# EAGLE design AVR ISP6 to ISP10 board 2 (EAGLE 5.07)
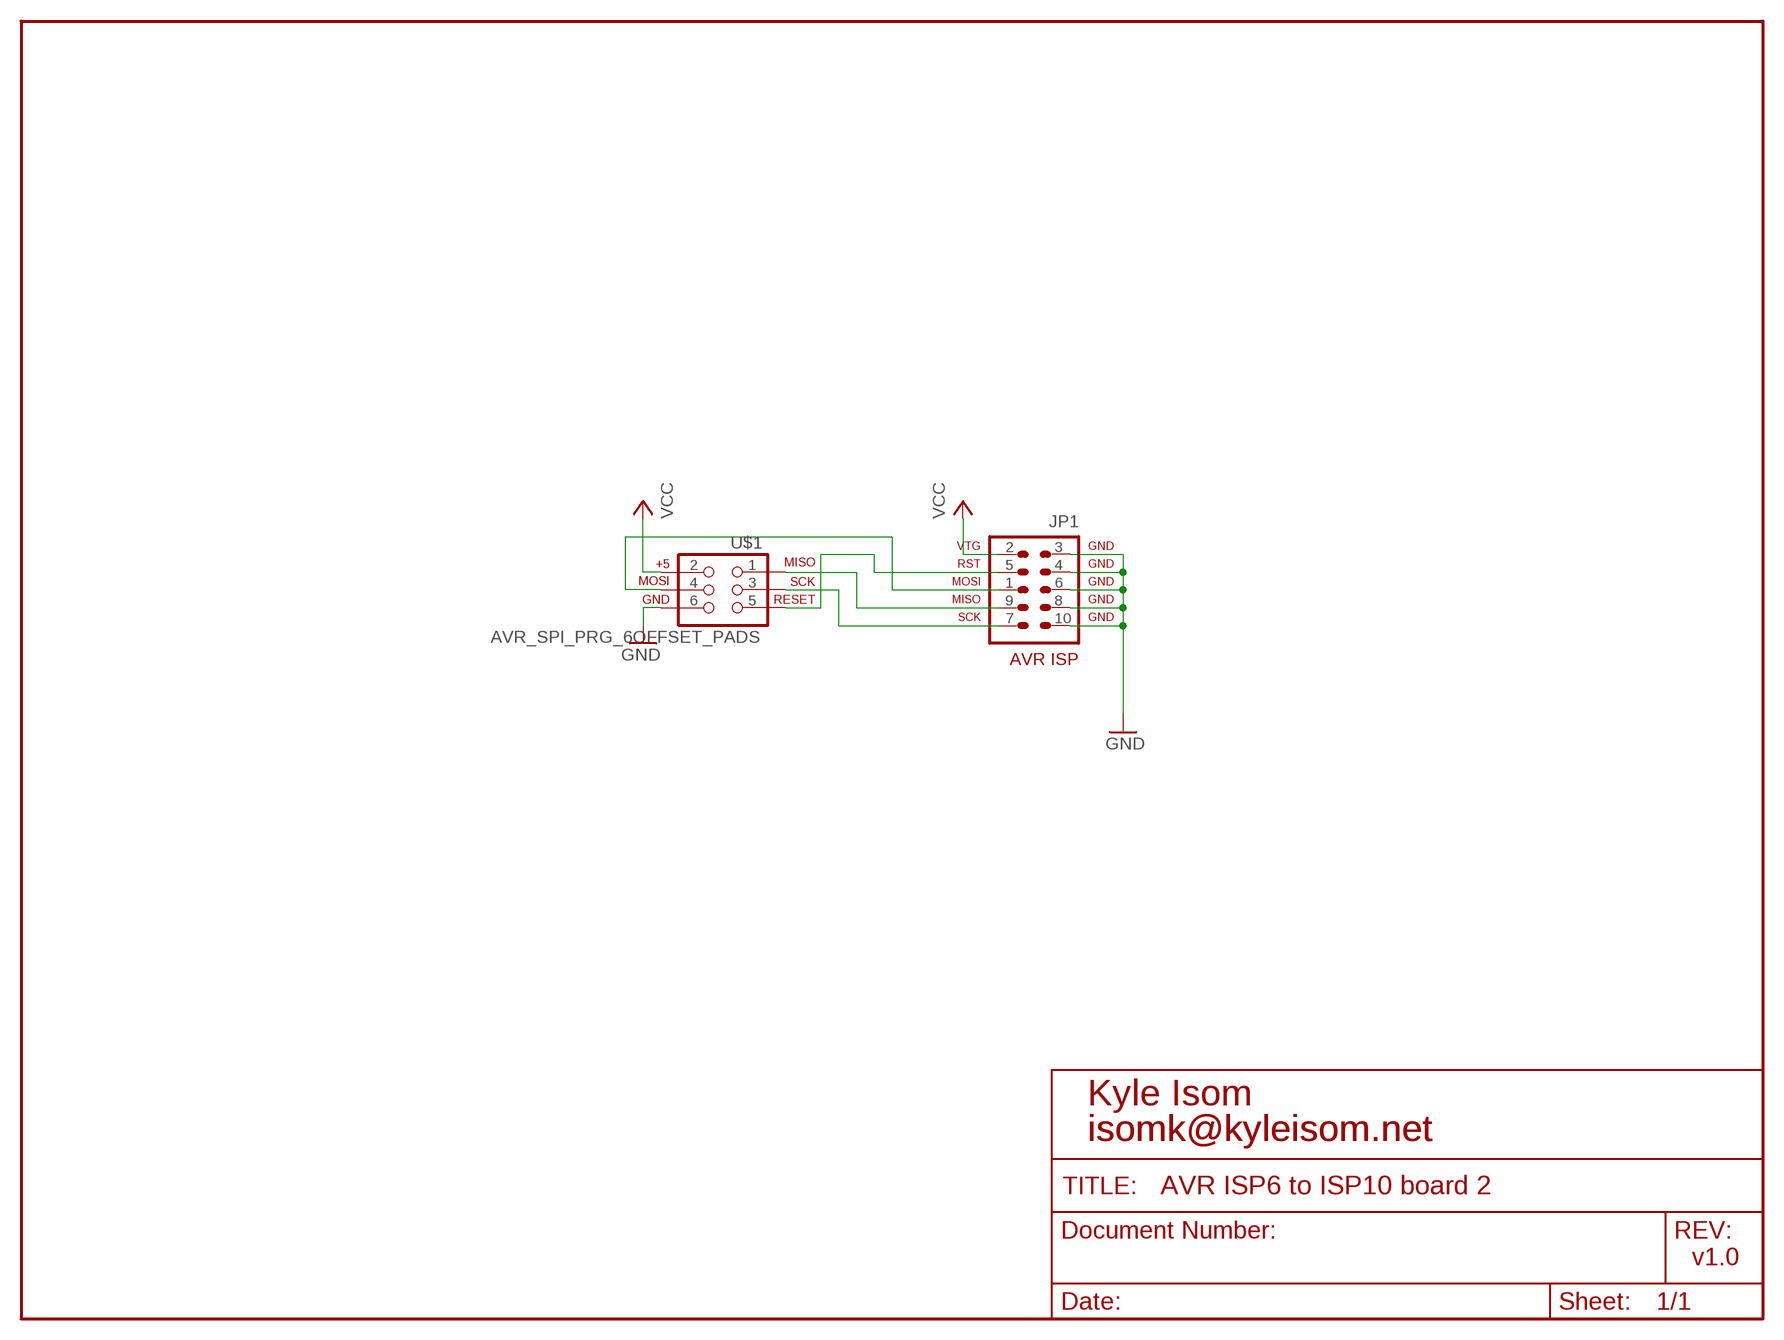
[diagram p0: schematic, sheet 1]

## Parts
JP1  AVR-ISP-10  [AVR-ISP-10]
U$1  AVR_SPI_PRG_6OFFSET_PADS  [2X3_OFFSET]

## Nets
GND: JP1.3 JP1.4 JP1.6 JP1.8 JP1.10 U$1.6
N$1: JP1.9 U$1.1
N$2: JP1.7 U$1.3
N$3: JP1.5 U$1.5
N$6: JP1.1 U$1.4
VCC: JP1.2 U$1.2

## Notes on the sheet
- Kyle Isom
- isomk@kyleisom.net | isomk@kyleisom.net
- v1.0

## Library data of the parts
JP1 = avr-6:AVR-ISP-10: AVR ISP-10 Serial Programming Header
U$1 = SparkFun:AVR_SPI_PRG_6: AVR ISP 6 Pin This is the reduced ISP connector for AVR programming. Common on Arduino. This footprint will take up less PCB space and can be used with a 10-pin to 6-pin adapter such as SKU: BOB-08508

## Board
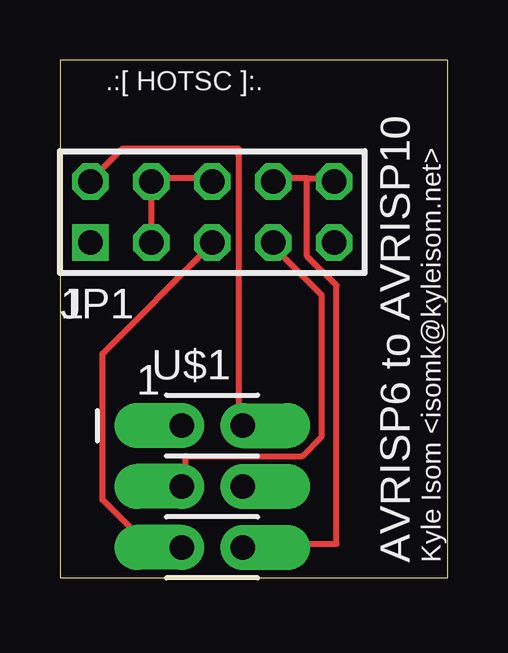
[diagram p1: board, top side]
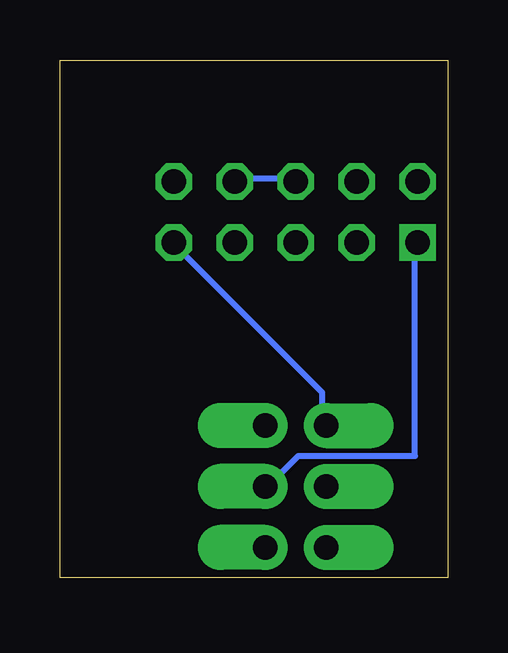
[diagram p2: board, bottom side, seen from below]

Size 16.18 x 21.58 mm. Coordinates in mm from the lower left corner, seen from the top.
Outline: 0,0 16.18,0 16.18,21.58 0,21.58 0,0
Copper layers (1*16): Top 0.035mm / dielectric 1.5mm / Bottom 0.035mm
Design rules "default": minimum track width 10mil, minimum drill 24mil, track to track 8mil, track to pad 8mil, pad to pad 8mil, via to via 8mil, smd to smd 8mil, copper to edge 40mil, drill to drill 8mil, minimum pad ring 10mil, minimum via ring 8mil, stop-mask expansion 4mil, vias tented up to drill 0mil, thermal gap 10mil

### Footprints (pad centres in the part's own frame; a part is rotated, then mirrored left to right if it is on the bottom)
AVR-ISP-10 = drill 1.016 square: 1 -5.08,-1.27 | drill 1.016 octagon: 2 -5.08,1.27; 3 -2.54,-1.27; 4 -2.54,1.27; 5 0,-1.27; 6 0,1.27; 7 2.54,-1.27; 8 2.54,1.27; 9 5.08,-1.27; 10 5.08,1.27
2X3_OFFSET = drill 1.016 pad 1.88 offset: 1 0,0; 2 0,2.54; 3 2.54,0; 4 2.54,2.54; 5 5.08,0; 6 5.08,2.54

### Placement (x,y rotation side)
JP1  6.35,15.24 0 top
U$1  5.08,6.35 270 top

### Tracks (layer width: path | path; a pad name or v marks a point on that pad's centre or on a via)
GND
  Top 0.254: JP1.3 JP1.4 3.81,16.66 6.25,16.66 JP1.6 | 10.31,16.66 8.89,16.66 JP1.8 | 10.31,16.66 11.33,16.66 JP1.10 | 10.31,16.66 10.31,13.41 11.53,12.19 11.53,1.42 7.67,1.42 U$1.6
  Bottom 0.254: JP1.6 6.45,16.66 8.89,16.66 JP1.8
N$1
  Bottom 0.254: JP1.9 11.33,13.82 5.23,7.72 5.23,6.5 U$1.1
N$2
  Top 0.254: JP1.7 8.89,13.82 10.92,11.79 10.92,5.89 10.11,5.08 5.23,5.08 5.23,3.86 U$1.3
N$3
  Top 0.254: JP1.5 6.25,13.82 1.78,9.35 1.78,3.25 3.61,1.42 5.03,1.42 U$1.5
N$6
  Bottom 0.254: JP1.1 1.37,13.82 1.37,5.08 6.25,5.08 7.47,3.86 U$1.4
VCC
  Top 0.254: JP1.2 1.37,16.66 2.59,17.88 7.47,17.88 7.47,6.5 U$1.2

### Text on the board
tPlace: .:[ HOTSC ]:. | 1 | 1 | AVRISP6 to AVRISP10 | Kyle Isom <isomk@kyleisom.net>